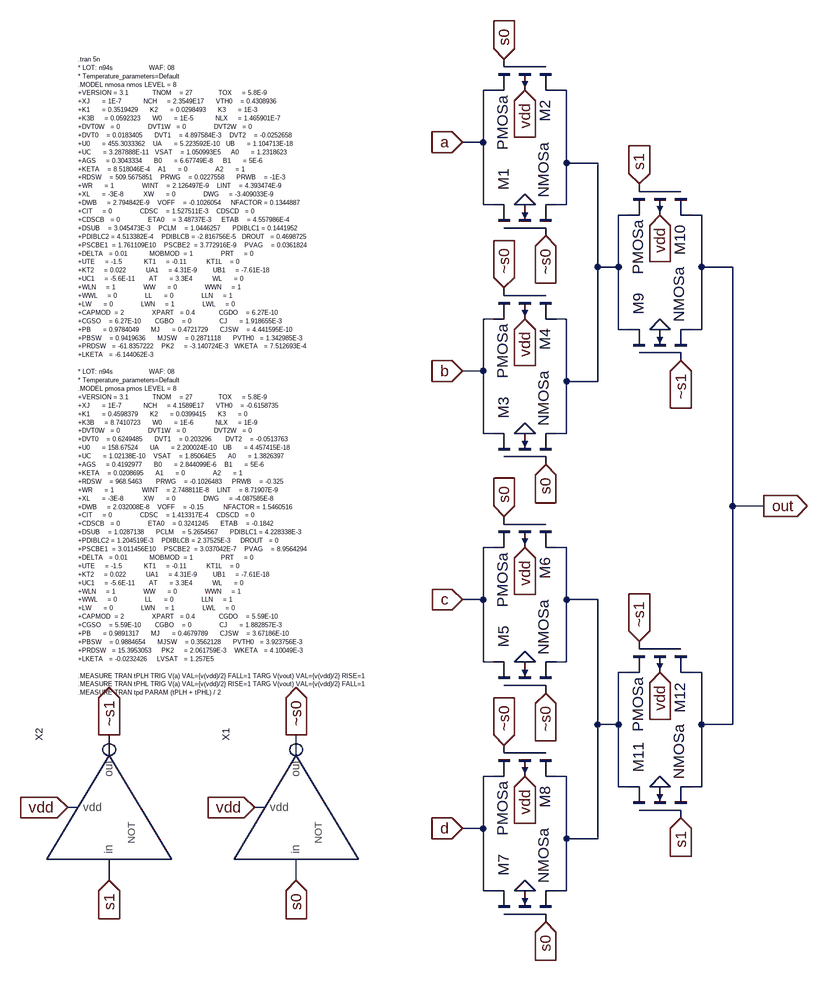
[diagram p0: schematic 41mux.asc]
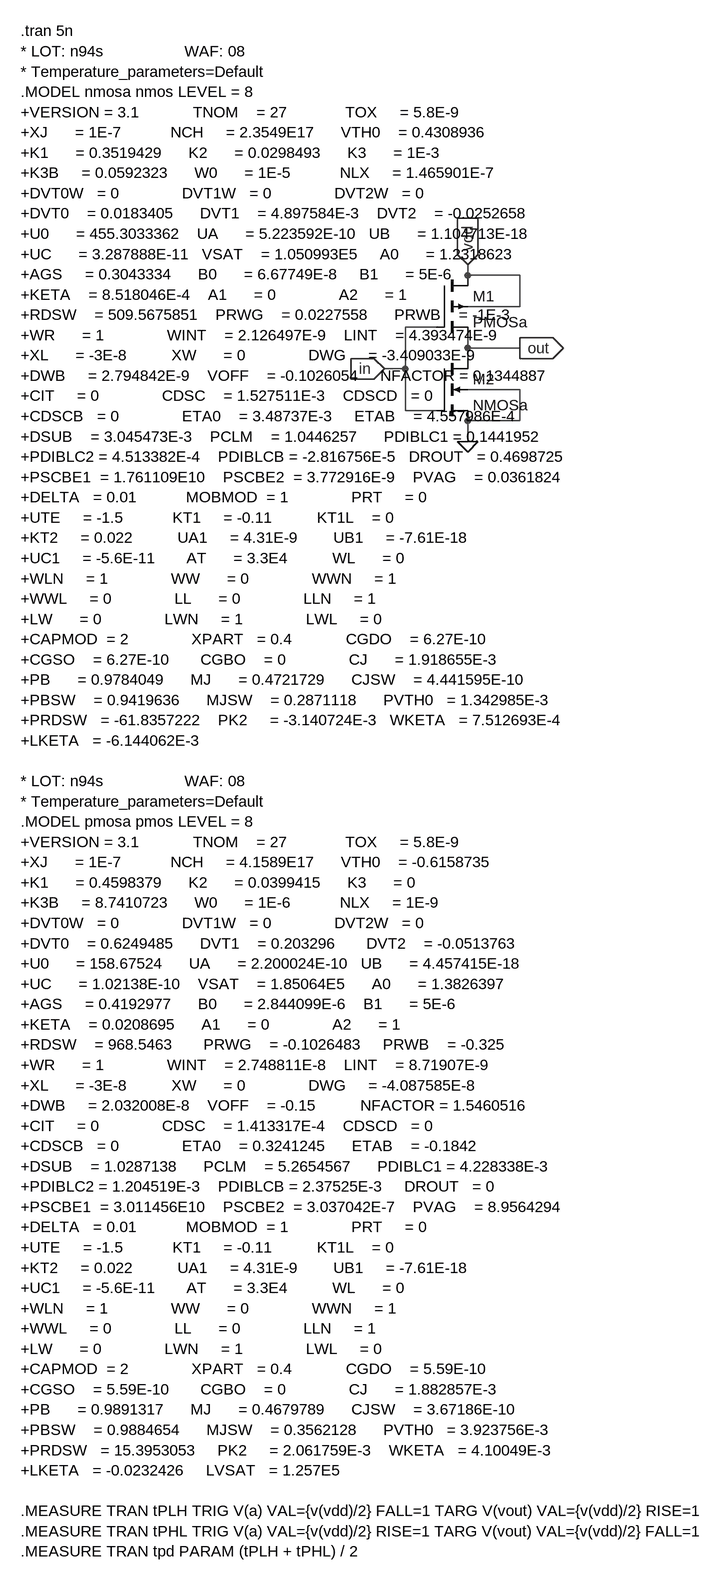
[diagram p1: sub-circuit not.asc]
41mux.asc, the LTspice schematic file:
Version 4.1
SHEET 1 1016 1432
WIRE 304 -112 288 -112
WIRE 416 -112 400 -112
WIRE 288 -32 288 -112
WIRE 288 -32 256 -32
WIRE 416 0 416 -112
WIRE 464 0 416 0
WIRE 288 64 288 -32
WIRE 304 64 288 64
WIRE 416 64 416 0
WIRE 416 64 400 64
WIRE 512 80 496 80
WIRE 624 80 608 80
WIRE 464 160 464 0
WIRE 496 160 496 80
WIRE 496 160 464 160
WIRE 624 160 624 80
WIRE 672 160 624 160
WIRE 304 240 288 240
WIRE 416 240 400 240
WIRE 496 256 496 160
WIRE 512 256 496 256
WIRE 624 256 624 160
WIRE 624 256 608 256
WIRE 288 320 288 240
WIRE 288 320 256 320
WIRE 416 336 416 240
WIRE 464 336 464 160
WIRE 464 336 416 336
WIRE 288 416 288 320
WIRE 304 416 288 416
WIRE 416 416 416 336
WIRE 416 416 400 416
WIRE 672 528 672 160
WIRE 720 528 672 528
WIRE 304 592 288 592
WIRE 416 592 400 592
WIRE 288 672 288 592
WIRE 288 672 256 672
WIRE 416 672 416 592
WIRE 464 672 416 672
WIRE 288 768 288 672
WIRE 304 768 288 768
WIRE 416 768 416 672
WIRE 416 768 400 768
WIRE 512 784 496 784
WIRE 624 784 608 784
WIRE 464 864 464 672
WIRE 496 864 496 784
WIRE 496 864 464 864
WIRE 624 864 624 784
WIRE 672 864 672 528
WIRE 672 864 624 864
WIRE -288 912 -288 880
WIRE 0 912 0 880
WIRE 304 944 288 944
WIRE 416 944 400 944
WIRE 496 960 496 864
WIRE 512 960 496 960
WIRE 624 960 624 864
WIRE 624 960 608 960
WIRE -336 992 -352 992
WIRE -48 992 -64 992
WIRE 288 1024 288 944
WIRE 288 1024 256 1024
WIRE 416 1040 416 944
WIRE 464 1040 464 864
WIRE 464 1040 416 1040
WIRE -288 1104 -288 1072
WIRE 0 1104 0 1072
WIRE 288 1120 288 1024
WIRE 304 1120 288 1120
WIRE 416 1120 416 1040
WIRE 416 1120 400 1120
FLAG 352 64 0
FLAG 352 -112 vdd
IOPIN 352 -112 In
FLAG 256 -32 a
IOPIN 256 -32 In
FLAG -64 992 vdd
IOPIN -64 992 In
FLAG 0 1104 s0
IOPIN 0 1104 In
FLAG 320 -160 s0
IOPIN 320 -160 In
FLAG 352 416 0
FLAG 352 240 vdd
IOPIN 352 240 In
FLAG 256 320 b
IOPIN 256 320 In
FLAG 320 192 ~s0
IOPIN 320 192 In
FLAG 352 768 0
FLAG 352 592 vdd
IOPIN 352 592 In
FLAG 256 672 c
IOPIN 256 672 In
FLAG 352 1120 0
FLAG 352 944 vdd
IOPIN 352 944 In
FLAG 256 1024 d
IOPIN 256 1024 In
FLAG 560 256 0
FLAG 560 80 vdd
IOPIN 560 80 In
FLAG 528 32 s1
IOPIN 528 32 In
FLAG 592 304 ~s1
IOPIN 592 304 In
FLAG 560 960 0
FLAG 560 784 vdd
IOPIN 560 784 In
FLAG 592 1008 s1
IOPIN 592 1008 In
FLAG 0 880 ~s0
IOPIN 0 880 Out
FLAG -352 992 vdd
IOPIN -352 992 In
FLAG -288 1104 s1
IOPIN -288 1104 In
FLAG -288 880 ~s1
IOPIN -288 880 Out
FLAG 720 528 out
IOPIN 720 528 Out
FLAG 320 544 s0
IOPIN 320 544 In
FLAG 384 464 s0
IOPIN 384 464 In
FLAG 384 1168 s0
IOPIN 384 1168 In
FLAG 384 112 ~s0
IOPIN 384 112 In
FLAG 384 816 ~s0
IOPIN 384 816 In
FLAG 320 896 ~s0
IOPIN 320 896 In
FLAG 528 736 ~s1
IOPIN 528 736 In
SYMBOL nmos4 304 112 R270
WINDOW 0 70 15 Left 2
WINDOW 3 59 77 Left 2
SYMATTR InstName M1
SYMATTR Value NMOSa
SYMATTR Value2 l=180n w=440n
SYMBOL pmos4 400 -160 R90
WINDOW 0 63 17 Left 2
WINDOW 3 56 82 Left 2
SYMATTR InstName M2
SYMATTR Value PMOSa
SYMATTR Value2 l=180n w=440n
SYMBOL NOT 16 992 R270
SYMATTR InstName X1
SYMBOL nmos4 304 464 R270
WINDOW 0 70 15 Left 2
WINDOW 3 59 77 Left 2
SYMATTR InstName M3
SYMATTR Value NMOSa
SYMATTR Value2 l=180n w=440n
SYMBOL pmos4 400 192 R90
WINDOW 0 63 17 Left 2
WINDOW 3 56 82 Left 2
SYMATTR InstName M4
SYMATTR Value PMOSa
SYMATTR Value2 l=180n w=440n
SYMBOL nmos4 304 816 R270
WINDOW 0 70 15 Left 2
WINDOW 3 59 77 Left 2
SYMATTR InstName M5
SYMATTR Value NMOSa
SYMATTR Value2 l=180n w=440n
SYMBOL pmos4 400 544 R90
WINDOW 0 63 17 Left 2
WINDOW 3 56 82 Left 2
SYMATTR InstName M6
SYMATTR Value PMOSa
SYMATTR Value2 l=180n w=440n
SYMBOL nmos4 304 1168 R270
WINDOW 0 70 15 Left 2
WINDOW 3 59 77 Left 2
SYMATTR InstName M7
SYMATTR Value NMOSa
SYMATTR Value2 l=180n w=440n
SYMBOL pmos4 400 896 R90
WINDOW 0 63 17 Left 2
WINDOW 3 56 82 Left 2
SYMATTR InstName M8
SYMATTR Value PMOSa
SYMATTR Value2 l=180n w=440n
SYMBOL nmos4 512 304 R270
WINDOW 0 70 15 Left 2
WINDOW 3 59 77 Left 2
SYMATTR InstName M9
SYMATTR Value NMOSa
SYMATTR Value2 l=180n w=440n
SYMBOL pmos4 608 32 R90
WINDOW 0 63 17 Left 2
WINDOW 3 56 82 Left 2
SYMATTR InstName M10
SYMATTR Value PMOSa
SYMATTR Value2 l=180n w=440n
SYMBOL nmos4 512 1008 R270
WINDOW 0 70 15 Left 2
WINDOW 3 59 77 Left 2
SYMATTR InstName M11
SYMATTR Value NMOSa
SYMATTR Value2 l=180n w=440n
SYMBOL pmos4 608 736 R90
WINDOW 0 63 17 Left 2
WINDOW 3 56 82 Left 2
SYMATTR InstName M12
SYMATTR Value PMOSa
SYMATTR Value2 l=180n w=440n
SYMBOL NOT -272 992 R270
SYMATTR InstName X2
TEXT -336 -160 Left 0 !.tran 5n\n* LOT: n94s                  WAF: 08\n* Temperature_parameters=Default\n.MODEL nmosa nmos LEVEL = 8\n+VERSION = 3.1            TNOM    = 27             TOX     = 5.8E-9\n+XJ      = 1E-7           NCH     = 2.3549E17      VTH0    = 0.4308936\n+K1      = 0.3519429      K2      = 0.0298493      K3      = 1E-3\n+K3B     = 0.0592323      W0      = 1E-5           NLX     = 1.465901E-7\n+DVT0W   = 0              DVT1W   = 0              DVT2W   = 0\n+DVT0    = 0.0183405      DVT1    = 4.897584E-3    DVT2    = -0.0252658\n+U0      = 455.3033362    UA      = 5.223592E-10   UB      = 1.104713E-18\n+UC      = 3.287888E-11   VSAT    = 1.050993E5     A0      = 1.2318623\n+AGS     = 0.3043334      B0      = 6.67749E-8     B1      = 5E-6\n+KETA    = 8.518046E-4    A1      = 0              A2      = 1\n+RDSW    = 509.5675851    PRWG    = 0.0227558      PRWB    = -1E-3\n+WR      = 1              WINT    = 2.126497E-9    LINT    = 4.393474E-9\n+XL      = -3E-8          XW      = 0              DWG     = -3.409033E-9\n+DWB     = 2.794842E-9    VOFF    = -0.1026054     NFACTOR = 0.1344887\n+CIT     = 0              CDSC    = 1.527511E-3    CDSCD   = 0\n+CDSCB   = 0              ETA0    = 3.48737E-3     ETAB    = 4.557986E-4\n+DSUB    = 3.045473E-3    PCLM    = 1.0446257      PDIBLC1 = 0.1441952\n+PDIBLC2 = 4.513382E-4    PDIBLCB = -2.816756E-5   DROUT   = 0.4698725\n+PSCBE1  = 1.761109E10    PSCBE2  = 3.772916E-9    PVAG    = 0.0361824\n+DELTA   = 0.01           MOBMOD  = 1              PRT     = 0\n+UTE     = -1.5           KT1     = -0.11          KT1L    = 0\n+KT2     = 0.022          UA1     = 4.31E-9        UB1     = -7.61E-18\n+UC1     = -5.6E-11       AT      = 3.3E4          WL      = 0\n+WLN     = 1              WW      = 0              WWN     = 1\n+WWL     = 0              LL      = 0              LLN     = 1\n+LW      = 0              LWN     = 1              LWL     = 0\n+CAPMOD  = 2              XPART   = 0.4            CGDO    = 6.27E-10\n+CGSO    = 6.27E-10       CGBO    = 0              CJ      = 1.918655E-3\n+PB      = 0.9784049      MJ      = 0.4721729      CJSW    = 4.441595E-10\n+PBSW    = 0.9419636      MJSW    = 0.2871118      PVTH0   = 1.342985E-3\n+PRDSW   = -61.8357222    PK2     = -3.140724E-3   WKETA   = 7.512693E-4\n+LKETA   = -6.144062E-3\n \n* LOT: n94s                  WAF: 08\n* Temperature_parameters=Default\n.MODEL pmosa pmos LEVEL = 8\n+VERSION = 3.1            TNOM    = 27             TOX     = 5.8E-9\n+XJ      = 1E-7           NCH     = 4.1589E17      VTH0    = -0.6158735\n+K1      = 0.4598379      K2      = 0.0399415      K3      = 0\n+K3B     = 8.7410723      W0      = 1E-6           NLX     = 1E-9\n+DVT0W   = 0              DVT1W   = 0              DVT2W   = 0\n+DVT0    = 0.6249485      DVT1    = 0.203296       DVT2    = -0.0513763\n+U0      = 158.67524      UA      = 2.200024E-10   UB      = 4.457415E-18\n+UC      = 1.02138E-10    VSAT    = 1.85064E5      A0      = 1.3826397\n+AGS     = 0.4192977      B0      = 2.844099E-6    B1      = 5E-6\n+KETA    = 0.0208695      A1      = 0              A2      = 1\n+RDSW    = 968.5463       PRWG    = -0.1026483     PRWB    = -0.325\n+WR      = 1              WINT    = 2.748811E-8    LINT    = 8.71907E-9\n+XL      = -3E-8          XW      = 0              DWG     = -4.087585E-8\n+DWB     = 2.032008E-8    VOFF    = -0.15          NFACTOR = 1.5460516\n+CIT     = 0              CDSC    = 1.413317E-4    CDSCD   = 0\n+CDSCB   = 0              ETA0    = 0.3241245      ETAB    = -0.1842\n+DSUB    = 1.0287138      PCLM    = 5.2654567      PDIBLC1 = 4.228338E-3\n+PDIBLC2 = 1.204519E-3    PDIBLCB = 2.37525E-3     DROUT   = 0\n+PSCBE1  = 3.011456E10    PSCBE2  = 3.037042E-7    PVAG    = 8.9564294\n+DELTA   = 0.01           MOBMOD  = 1              PRT     = 0\n+UTE     = -1.5           KT1     = -0.11          KT1L    = 0\n+KT2     = 0.022          UA1     = 4.31E-9        UB1     = -7.61E-18\n+UC1     = -5.6E-11       AT      = 3.3E4          WL      = 0\n+WLN     = 1              WW      = 0              WWN     = 1\n+WWL     = 0              LL      = 0              LLN     = 1\n+LW      = 0              LWN     = 1              LWL     = 0\n+CAPMOD  = 2              XPART   = 0.4            CGDO    = 5.59E-10\n+CGSO    = 5.59E-10       CGBO    = 0              CJ      = 1.882857E-3\n+PB      = 0.9891317      MJ      = 0.4679789      CJSW    = 3.67186E-10\n+PBSW    = 0.9884654      MJSW    = 0.3562128      PVTH0   = 3.923756E-3\n+PRDSW   = 15.3953053     PK2     = 2.061759E-3    WKETA   = 4.10049E-3\n+LKETA   = -0.0232426     LVSAT   = 1.257E5\n \n.MEASURE TRAN tPLH TRIG V(a) VAL={v(vdd)/2} FALL=1 TARG V(vout) VAL={v(vdd)/2} RISE=1\n.MEASURE TRAN tPHL TRIG V(a) VAL={v(vdd)/2} RISE=1 TARG V(vout) VAL={v(vdd)/2} FALL=1\n.MEASURE TRAN tpd PARAM (tPLH + tPHL) / 2

not.asc, the sub-circuit schematic file:
Version 4.1
SHEET 1 1424 808
WIRE -48 48 -48 32
WIRE 32 48 -48 48
WIRE 32 96 32 48
WIRE 32 96 -48 96
WIRE -96 128 -144 128
WIRE -48 160 -48 144
WIRE 32 160 -48 160
WIRE -48 176 -48 160
WIRE -144 192 -144 128
WIRE -144 192 -176 192
WIRE 32 224 -48 224
WIRE -144 256 -144 192
WIRE -96 256 -144 256
WIRE 32 272 32 224
WIRE 32 272 -48 272
WIRE -48 304 -48 272
FLAG -48 304 0
FLAG -48 32 vdd
IOPIN -48 32 In
FLAG -176 192 in
IOPIN -176 192 In
FLAG 32 160 out
IOPIN 32 160 Out
SYMBOL pmos4 -96 48 R0
SYMATTR InstName M1
SYMATTR Value2 l=180n w=880n
SYMATTR Value PMOSa
SYMBOL nmos4 -96 176 R0
SYMATTR InstName M2
SYMATTR Value2 l=180n w=440n
SYMATTR Value NMOSa
TEXT -736 -328 Left 0 !.tran 5n\n* LOT: n94s                  WAF: 08\n* Temperature_parameters=Default\n.MODEL nmosa nmos LEVEL = 8\n+VERSION = 3.1            TNOM    = 27             TOX     = 5.8E-9\n+XJ      = 1E-7           NCH     = 2.3549E17      VTH0    = 0.4308936\n+K1      = 0.3519429      K2      = 0.0298493      K3      = 1E-3\n+K3B     = 0.0592323      W0      = 1E-5           NLX     = 1.465901E-7\n+DVT0W   = 0              DVT1W   = 0              DVT2W   = 0\n+DVT0    = 0.0183405      DVT1    = 4.897584E-3    DVT2    = -0.0252658\n+U0      = 455.3033362    UA      = 5.223592E-10   UB      = 1.104713E-18\n+UC      = 3.287888E-11   VSAT    = 1.050993E5     A0      = 1.2318623\n+AGS     = 0.3043334      B0      = 6.67749E-8     B1      = 5E-6\n+KETA    = 8.518046E-4    A1      = 0              A2      = 1\n+RDSW    = 509.5675851    PRWG    = 0.0227558      PRWB    = -1E-3\n+WR      = 1              WINT    = 2.126497E-9    LINT    = 4.393474E-9\n+XL      = -3E-8          XW      = 0              DWG     = -3.409033E-9\n+DWB     = 2.794842E-9    VOFF    = -0.1026054     NFACTOR = 0.1344887\n+CIT     = 0              CDSC    = 1.527511E-3    CDSCD   = 0\n+CDSCB   = 0              ETA0    = 3.48737E-3     ETAB    = 4.557986E-4\n+DSUB    = 3.045473E-3    PCLM    = 1.0446257      PDIBLC1 = 0.1441952\n+PDIBLC2 = 4.513382E-4    PDIBLCB = -2.816756E-5   DROUT   = 0.4698725\n+PSCBE1  = 1.761109E10    PSCBE2  = 3.772916E-9    PVAG    = 0.0361824\n+DELTA   = 0.01           MOBMOD  = 1              PRT     = 0\n+UTE     = -1.5           KT1     = -0.11          KT1L    = 0\n+KT2     = 0.022          UA1     = 4.31E-9        UB1     = -7.61E-18\n+UC1     = -5.6E-11       AT      = 3.3E4          WL      = 0\n+WLN     = 1              WW      = 0              WWN     = 1\n+WWL     = 0              LL      = 0              LLN     = 1\n+LW      = 0              LWN     = 1              LWL     = 0\n+CAPMOD  = 2              XPART   = 0.4            CGDO    = 6.27E-10\n+CGSO    = 6.27E-10       CGBO    = 0              CJ      = 1.918655E-3\n+PB      = 0.9784049      MJ      = 0.4721729      CJSW    = 4.441595E-10\n+PBSW    = 0.9419636      MJSW    = 0.2871118      PVTH0   = 1.342985E-3\n+PRDSW   = -61.8357222    PK2     = -3.140724E-3   WKETA   = 7.512693E-4\n+LKETA   = -6.144062E-3\n \n* LOT: n94s                  WAF: 08\n* Temperature_parameters=Default\n.MODEL pmosa pmos LEVEL = 8\n+VERSION = 3.1            TNOM    = 27             TOX     = 5.8E-9\n+XJ      = 1E-7           NCH     = 4.1589E17      VTH0    = -0.6158735\n+K1      = 0.4598379      K2      = 0.0399415      K3      = 0\n+K3B     = 8.7410723      W0      = 1E-6           NLX     = 1E-9\n+DVT0W   = 0              DVT1W   = 0              DVT2W   = 0\n+DVT0    = 0.6249485      DVT1    = 0.203296       DVT2    = -0.0513763\n+U0      = 158.67524      UA      = 2.200024E-10   UB      = 4.457415E-18\n+UC      = 1.02138E-10    VSAT    = 1.85064E5      A0      = 1.3826397\n+AGS     = 0.4192977      B0      = 2.844099E-6    B1      = 5E-6\n+KETA    = 0.0208695      A1      = 0              A2      = 1\n+RDSW    = 968.5463       PRWG    = -0.1026483     PRWB    = -0.325\n+WR      = 1              WINT    = 2.748811E-8    LINT    = 8.71907E-9\n+XL      = -3E-8          XW      = 0              DWG     = -4.087585E-8\n+DWB     = 2.032008E-8    VOFF    = -0.15          NFACTOR = 1.5460516\n+CIT     = 0              CDSC    = 1.413317E-4    CDSCD   = 0\n+CDSCB   = 0              ETA0    = 0.3241245      ETAB    = -0.1842\n+DSUB    = 1.0287138      PCLM    = 5.2654567      PDIBLC1 = 4.228338E-3\n+PDIBLC2 = 1.204519E-3    PDIBLCB = 2.37525E-3     DROUT   = 0\n+PSCBE1  = 3.011456E10    PSCBE2  = 3.037042E-7    PVAG    = 8.9564294\n+DELTA   = 0.01           MOBMOD  = 1              PRT     = 0\n+UTE     = -1.5           KT1     = -0.11          KT1L    = 0\n+KT2     = 0.022          UA1     = 4.31E-9        UB1     = -7.61E-18\n+UC1     = -5.6E-11       AT      = 3.3E4          WL      = 0\n+WLN     = 1              WW      = 0              WWN     = 1\n+WWL     = 0              LL      = 0              LLN     = 1\n+LW      = 0              LWN     = 1              LWL     = 0\n+CAPMOD  = 2              XPART   = 0.4            CGDO    = 5.59E-10\n+CGSO    = 5.59E-10       CGBO    = 0              CJ      = 1.882857E-3\n+PB      = 0.9891317      MJ      = 0.4679789      CJSW    = 3.67186E-10\n+PBSW    = 0.9884654      MJSW    = 0.3562128      PVTH0   = 3.923756E-3\n+PRDSW   = 15.3953053     PK2     = 2.061759E-3    WKETA   = 4.10049E-3\n+LKETA   = -0.0232426     LVSAT   = 1.257E5\n \n.MEASURE TRAN tPLH TRIG V(a) VAL={v(vdd)/2} FALL=1 TARG V(vout) VAL={v(vdd)/2} RISE=1\n.MEASURE TRAN tPHL TRIG V(a) VAL={v(vdd)/2} RISE=1 TARG V(vout) VAL={v(vdd)/2} FALL=1\n.MEASURE TRAN tpd PARAM (tPLH + tPHL) / 2

The netlist it stands for:
* 41mux.asc
M1 a ~s0 N001 0 NMOSa l=180n w=440n
M2 N001 s0 a vdd PMOSa l=180n w=440n
X§X1 s0 vdd ~s0 not
M3 b s0 N001 0 NMOSa l=180n w=440n
M4 N001 ~s0 b vdd PMOSa l=180n w=440n
M5 c ~s0 N002 0 NMOSa l=180n w=440n
M6 N002 s0 c vdd PMOSa l=180n w=440n
M7 d s0 N002 0 NMOSa l=180n w=440n
M8 N002 ~s0 d vdd PMOSa l=180n w=440n
M9 N001 ~s1 out 0 NMOSa l=180n w=440n
M10 out s1 N001 vdd PMOSa l=180n w=440n
M11 N002 s1 out 0 NMOSa l=180n w=440n
M12 out ~s1 N002 vdd PMOSa l=180n w=440n
X§X2 s1 vdd ~s1 not

* block symbol definitions
.subckt not in vdd out
M1 vdd in out vdd PMOSa l=180n w=880n
M2 out in 0 0 NMOSa l=180n w=440n
.tran 5n
* LOT: n94s                  WAF: 08
* Temperature_parameters=Default
.MODEL nmosa nmos LEVEL = 8
+VERSION = 3.1            TNOM    = 27             TOX     = 5.8E-9
+XJ      = 1E-7           NCH     = 2.3549E17      VTH0    = 0.4308936
+K1      = 0.3519429      K2      = 0.0298493      K3      = 1E-3
+K3B     = 0.0592323      W0      = 1E-5           NLX     = 1.465901E-7
+DVT0W   = 0              DVT1W   = 0              DVT2W   = 0
+DVT0    = 0.0183405      DVT1    = 4.897584E-3    DVT2    = -0.0252658
+U0      = 455.3033362    UA      = 5.223592E-10   UB      = 1.104713E-18
+UC      = 3.287888E-11   VSAT    = 1.050993E5     A0      = 1.2318623
+AGS     = 0.3043334      B0      = 6.67749E-8     B1      = 5E-6
+KETA    = 8.518046E-4    A1      = 0              A2      = 1
+RDSW    = 509.5675851    PRWG    = 0.0227558      PRWB    = -1E-3
+WR      = 1              WINT    = 2.126497E-9    LINT    = 4.393474E-9
+XL      = -3E-8          XW      = 0              DWG     = -3.409033E-9
+DWB     = 2.794842E-9    VOFF    = -0.1026054     NFACTOR = 0.1344887
+CIT     = 0              CDSC    = 1.527511E-3    CDSCD   = 0
+CDSCB   = 0              ETA0    = 3.48737E-3     ETAB    = 4.557986E-4
+DSUB    = 3.045473E-3    PCLM    = 1.0446257      PDIBLC1 = 0.1441952
+PDIBLC2 = 4.513382E-4    PDIBLCB = -2.816756E-5   DROUT   = 0.4698725
+PSCBE1  = 1.761109E10    PSCBE2  = 3.772916E-9    PVAG    = 0.0361824
+DELTA   = 0.01           MOBMOD  = 1              PRT     = 0
+UTE     = -1.5           KT1     = -0.11          KT1L    = 0
+KT2     = 0.022          UA1     = 4.31E-9        UB1     = -7.61E-18
+UC1     = -5.6E-11       AT      = 3.3E4          WL      = 0
+WLN     = 1              WW      = 0              WWN     = 1
+WWL     = 0              LL      = 0              LLN     = 1
+LW      = 0              LWN     = 1              LWL     = 0
+CAPMOD  = 2              XPART   = 0.4            CGDO    = 6.27E-10
+CGSO    = 6.27E-10       CGBO    = 0              CJ      = 1.918655E-3
+PB      = 0.9784049      MJ      = 0.4721729      CJSW    = 4.441595E-10
+PBSW    = 0.9419636      MJSW    = 0.2871118      PVTH0   = 1.342985E-3
+PRDSW   = -61.8357222    PK2     = -3.140724E-3   WKETA   = 7.512693E-4
+LKETA   = -6.144062E-3
* LOT: n94s                  WAF: 08
* Temperature_parameters=Default
.MODEL pmosa pmos LEVEL = 8
+VERSION = 3.1            TNOM    = 27             TOX     = 5.8E-9
+XJ      = 1E-7           NCH     = 4.1589E17      VTH0    = -0.6158735
+K1      = 0.4598379      K2      = 0.0399415      K3      = 0
+K3B     = 8.7410723      W0      = 1E-6           NLX     = 1E-9
+DVT0W   = 0              DVT1W   = 0              DVT2W   = 0
+DVT0    = 0.6249485      DVT1    = 0.203296       DVT2    = -0.0513763
+U0      = 158.67524      UA      = 2.200024E-10   UB      = 4.457415E-18
+UC      = 1.02138E-10    VSAT    = 1.85064E5      A0      = 1.3826397
+AGS     = 0.4192977      B0      = 2.844099E-6    B1      = 5E-6
+KETA    = 0.0208695      A1      = 0              A2      = 1
+RDSW    = 968.5463       PRWG    = -0.1026483     PRWB    = -0.325
+WR      = 1              WINT    = 2.748811E-8    LINT    = 8.71907E-9
+XL      = -3E-8          XW      = 0              DWG     = -4.087585E-8
+DWB     = 2.032008E-8    VOFF    = -0.15          NFACTOR = 1.5460516
+CIT     = 0              CDSC    = 1.413317E-4    CDSCD   = 0
+CDSCB   = 0              ETA0    = 0.3241245      ETAB    = -0.1842
+DSUB    = 1.0287138      PCLM    = 5.2654567      PDIBLC1 = 4.228338E-3
+PDIBLC2 = 1.204519E-3    PDIBLCB = 2.37525E-3     DROUT   = 0
+PSCBE1  = 3.011456E10    PSCBE2  = 3.037042E-7    PVAG    = 8.9564294
+DELTA   = 0.01           MOBMOD  = 1              PRT     = 0
+UTE     = -1.5           KT1     = -0.11          KT1L    = 0
+KT2     = 0.022          UA1     = 4.31E-9        UB1     = -7.61E-18
+UC1     = -5.6E-11       AT      = 3.3E4          WL      = 0
+WLN     = 1              WW      = 0              WWN     = 1
+WWL     = 0              LL      = 0              LLN     = 1
+LW      = 0              LWN     = 1              LWL     = 0
+CAPMOD  = 2              XPART   = 0.4            CGDO    = 5.59E-10
+CGSO    = 5.59E-10       CGBO    = 0              CJ      = 1.882857E-3
+PB      = 0.9891317      MJ      = 0.4679789      CJSW    = 3.67186E-10
+PBSW    = 0.9884654      MJSW    = 0.3562128      PVTH0   = 3.923756E-3
+PRDSW   = 15.3953053     PK2     = 2.061759E-3    WKETA   = 4.10049E-3
+LKETA   = -0.0232426     LVSAT   = 1.257E5
.MEASURE TRAN tPLH TRIG V(a) VAL={v(vdd)/2} FALL=1 TARG V(vout) VAL={v(vdd)/2} RISE=1
.MEASURE TRAN tPHL TRIG V(a) VAL={v(vdd)/2} RISE=1 TARG V(vout) VAL={v(vdd)/2} FALL=1
.MEASURE TRAN tpd PARAM (tPLH + tPHL) / 2
.ends not

.model NMOS NMOS
.model PMOS PMOS
.lib standard.mos
.tran 5n
* LOT: n94s                  WAF: 08
* Temperature_parameters=Default
.MODEL nmosa nmos LEVEL = 8
+VERSION = 3.1            TNOM    = 27             TOX     = 5.8E-9
+XJ      = 1E-7           NCH     = 2.3549E17      VTH0    = 0.4308936
+K1      = 0.3519429      K2      = 0.0298493      K3      = 1E-3
+K3B     = 0.0592323      W0      = 1E-5           NLX     = 1.465901E-7
+DVT0W   = 0              DVT1W   = 0              DVT2W   = 0
+DVT0    = 0.0183405      DVT1    = 4.897584E-3    DVT2    = -0.0252658
+U0      = 455.3033362    UA      = 5.223592E-10   UB      = 1.104713E-18
+UC      = 3.287888E-11   VSAT    = 1.050993E5     A0      = 1.2318623
+AGS     = 0.3043334      B0      = 6.67749E-8     B1      = 5E-6
+KETA    = 8.518046E-4    A1      = 0              A2      = 1
+RDSW    = 509.5675851    PRWG    = 0.0227558      PRWB    = -1E-3
+WR      = 1              WINT    = 2.126497E-9    LINT    = 4.393474E-9
+XL      = -3E-8          XW      = 0              DWG     = -3.409033E-9
+DWB     = 2.794842E-9    VOFF    = -0.1026054     NFACTOR = 0.1344887
+CIT     = 0              CDSC    = 1.527511E-3    CDSCD   = 0
+CDSCB   = 0              ETA0    = 3.48737E-3     ETAB    = 4.557986E-4
+DSUB    = 3.045473E-3    PCLM    = 1.0446257      PDIBLC1 = 0.1441952
+PDIBLC2 = 4.513382E-4    PDIBLCB = -2.816756E-5   DROUT   = 0.4698725
+PSCBE1  = 1.761109E10    PSCBE2  = 3.772916E-9    PVAG    = 0.0361824
+DELTA   = 0.01           MOBMOD  = 1              PRT     = 0
+UTE     = -1.5           KT1     = -0.11          KT1L    = 0
+KT2     = 0.022          UA1     = 4.31E-9        UB1     = -7.61E-18
+UC1     = -5.6E-11       AT      = 3.3E4          WL      = 0
+WLN     = 1              WW      = 0              WWN     = 1
+WWL     = 0              LL      = 0              LLN     = 1
+LW      = 0              LWN     = 1              LWL     = 0
+CAPMOD  = 2              XPART   = 0.4            CGDO    = 6.27E-10
+CGSO    = 6.27E-10       CGBO    = 0              CJ      = 1.918655E-3
+PB      = 0.9784049      MJ      = 0.4721729      CJSW    = 4.441595E-10
+PBSW    = 0.9419636      MJSW    = 0.2871118      PVTH0   = 1.342985E-3
+PRDSW   = -61.8357222    PK2     = -3.140724E-3   WKETA   = 7.512693E-4
+LKETA   = -6.144062E-3
* LOT: n94s                  WAF: 08
* Temperature_parameters=Default
.MODEL pmosa pmos LEVEL = 8
+VERSION = 3.1            TNOM    = 27             TOX     = 5.8E-9
+XJ      = 1E-7           NCH     = 4.1589E17      VTH0    = -0.6158735
+K1      = 0.4598379      K2      = 0.0399415      K3      = 0
+K3B     = 8.7410723      W0      = 1E-6           NLX     = 1E-9
+DVT0W   = 0              DVT1W   = 0              DVT2W   = 0
+DVT0    = 0.6249485      DVT1    = 0.203296       DVT2    = -0.0513763
+U0      = 158.67524      UA      = 2.200024E-10   UB      = 4.457415E-18
+UC      = 1.02138E-10    VSAT    = 1.85064E5      A0      = 1.3826397
+AGS     = 0.4192977      B0      = 2.844099E-6    B1      = 5E-6
+KETA    = 0.0208695      A1      = 0              A2      = 1
+RDSW    = 968.5463       PRWG    = -0.1026483     PRWB    = -0.325
+WR      = 1              WINT    = 2.748811E-8    LINT    = 8.71907E-9
+XL      = -3E-8          XW      = 0              DWG     = -4.087585E-8
+DWB     = 2.032008E-8    VOFF    = -0.15          NFACTOR = 1.5460516
+CIT     = 0              CDSC    = 1.413317E-4    CDSCD   = 0
+CDSCB   = 0              ETA0    = 0.3241245      ETAB    = -0.1842
+DSUB    = 1.0287138      PCLM    = 5.2654567      PDIBLC1 = 4.228338E-3
+PDIBLC2 = 1.204519E-3    PDIBLCB = 2.37525E-3     DROUT   = 0
+PSCBE1  = 3.011456E10    PSCBE2  = 3.037042E-7    PVAG    = 8.9564294
+DELTA   = 0.01           MOBMOD  = 1              PRT     = 0
+UTE     = -1.5           KT1     = -0.11          KT1L    = 0
+KT2     = 0.022          UA1     = 4.31E-9        UB1     = -7.61E-18
+UC1     = -5.6E-11       AT      = 3.3E4          WL      = 0
+WLN     = 1              WW      = 0              WWN     = 1
+WWL     = 0              LL      = 0              LLN     = 1
+LW      = 0              LWN     = 1              LWL     = 0
+CAPMOD  = 2              XPART   = 0.4            CGDO    = 5.59E-10
+CGSO    = 5.59E-10       CGBO    = 0              CJ      = 1.882857E-3
+PB      = 0.9891317      MJ      = 0.4679789      CJSW    = 3.67186E-10
+PBSW    = 0.9884654      MJSW    = 0.3562128      PVTH0   = 3.923756E-3
+PRDSW   = 15.3953053     PK2     = 2.061759E-3    WKETA   = 4.10049E-3
+LKETA   = -0.0232426     LVSAT   = 1.257E5
.MEASURE TRAN tPLH TRIG V(a) VAL={v(vdd)/2} FALL=1 TARG V(vout) VAL={v(vdd)/2} RISE=1
.MEASURE TRAN tPHL TRIG V(a) VAL={v(vdd)/2} RISE=1 TARG V(vout) VAL={v(vdd)/2} FALL=1
.MEASURE TRAN tpd PARAM (tPLH + tPHL) / 2
.backanno
.end